# EasyEDA schematic SCH_USBHub_2025-11-01.json
TITLE: YetAnotherUSBHub; REV: 1.0; Date: 2025-10-31; Sheet: 1/1; Drawn By: 0x62
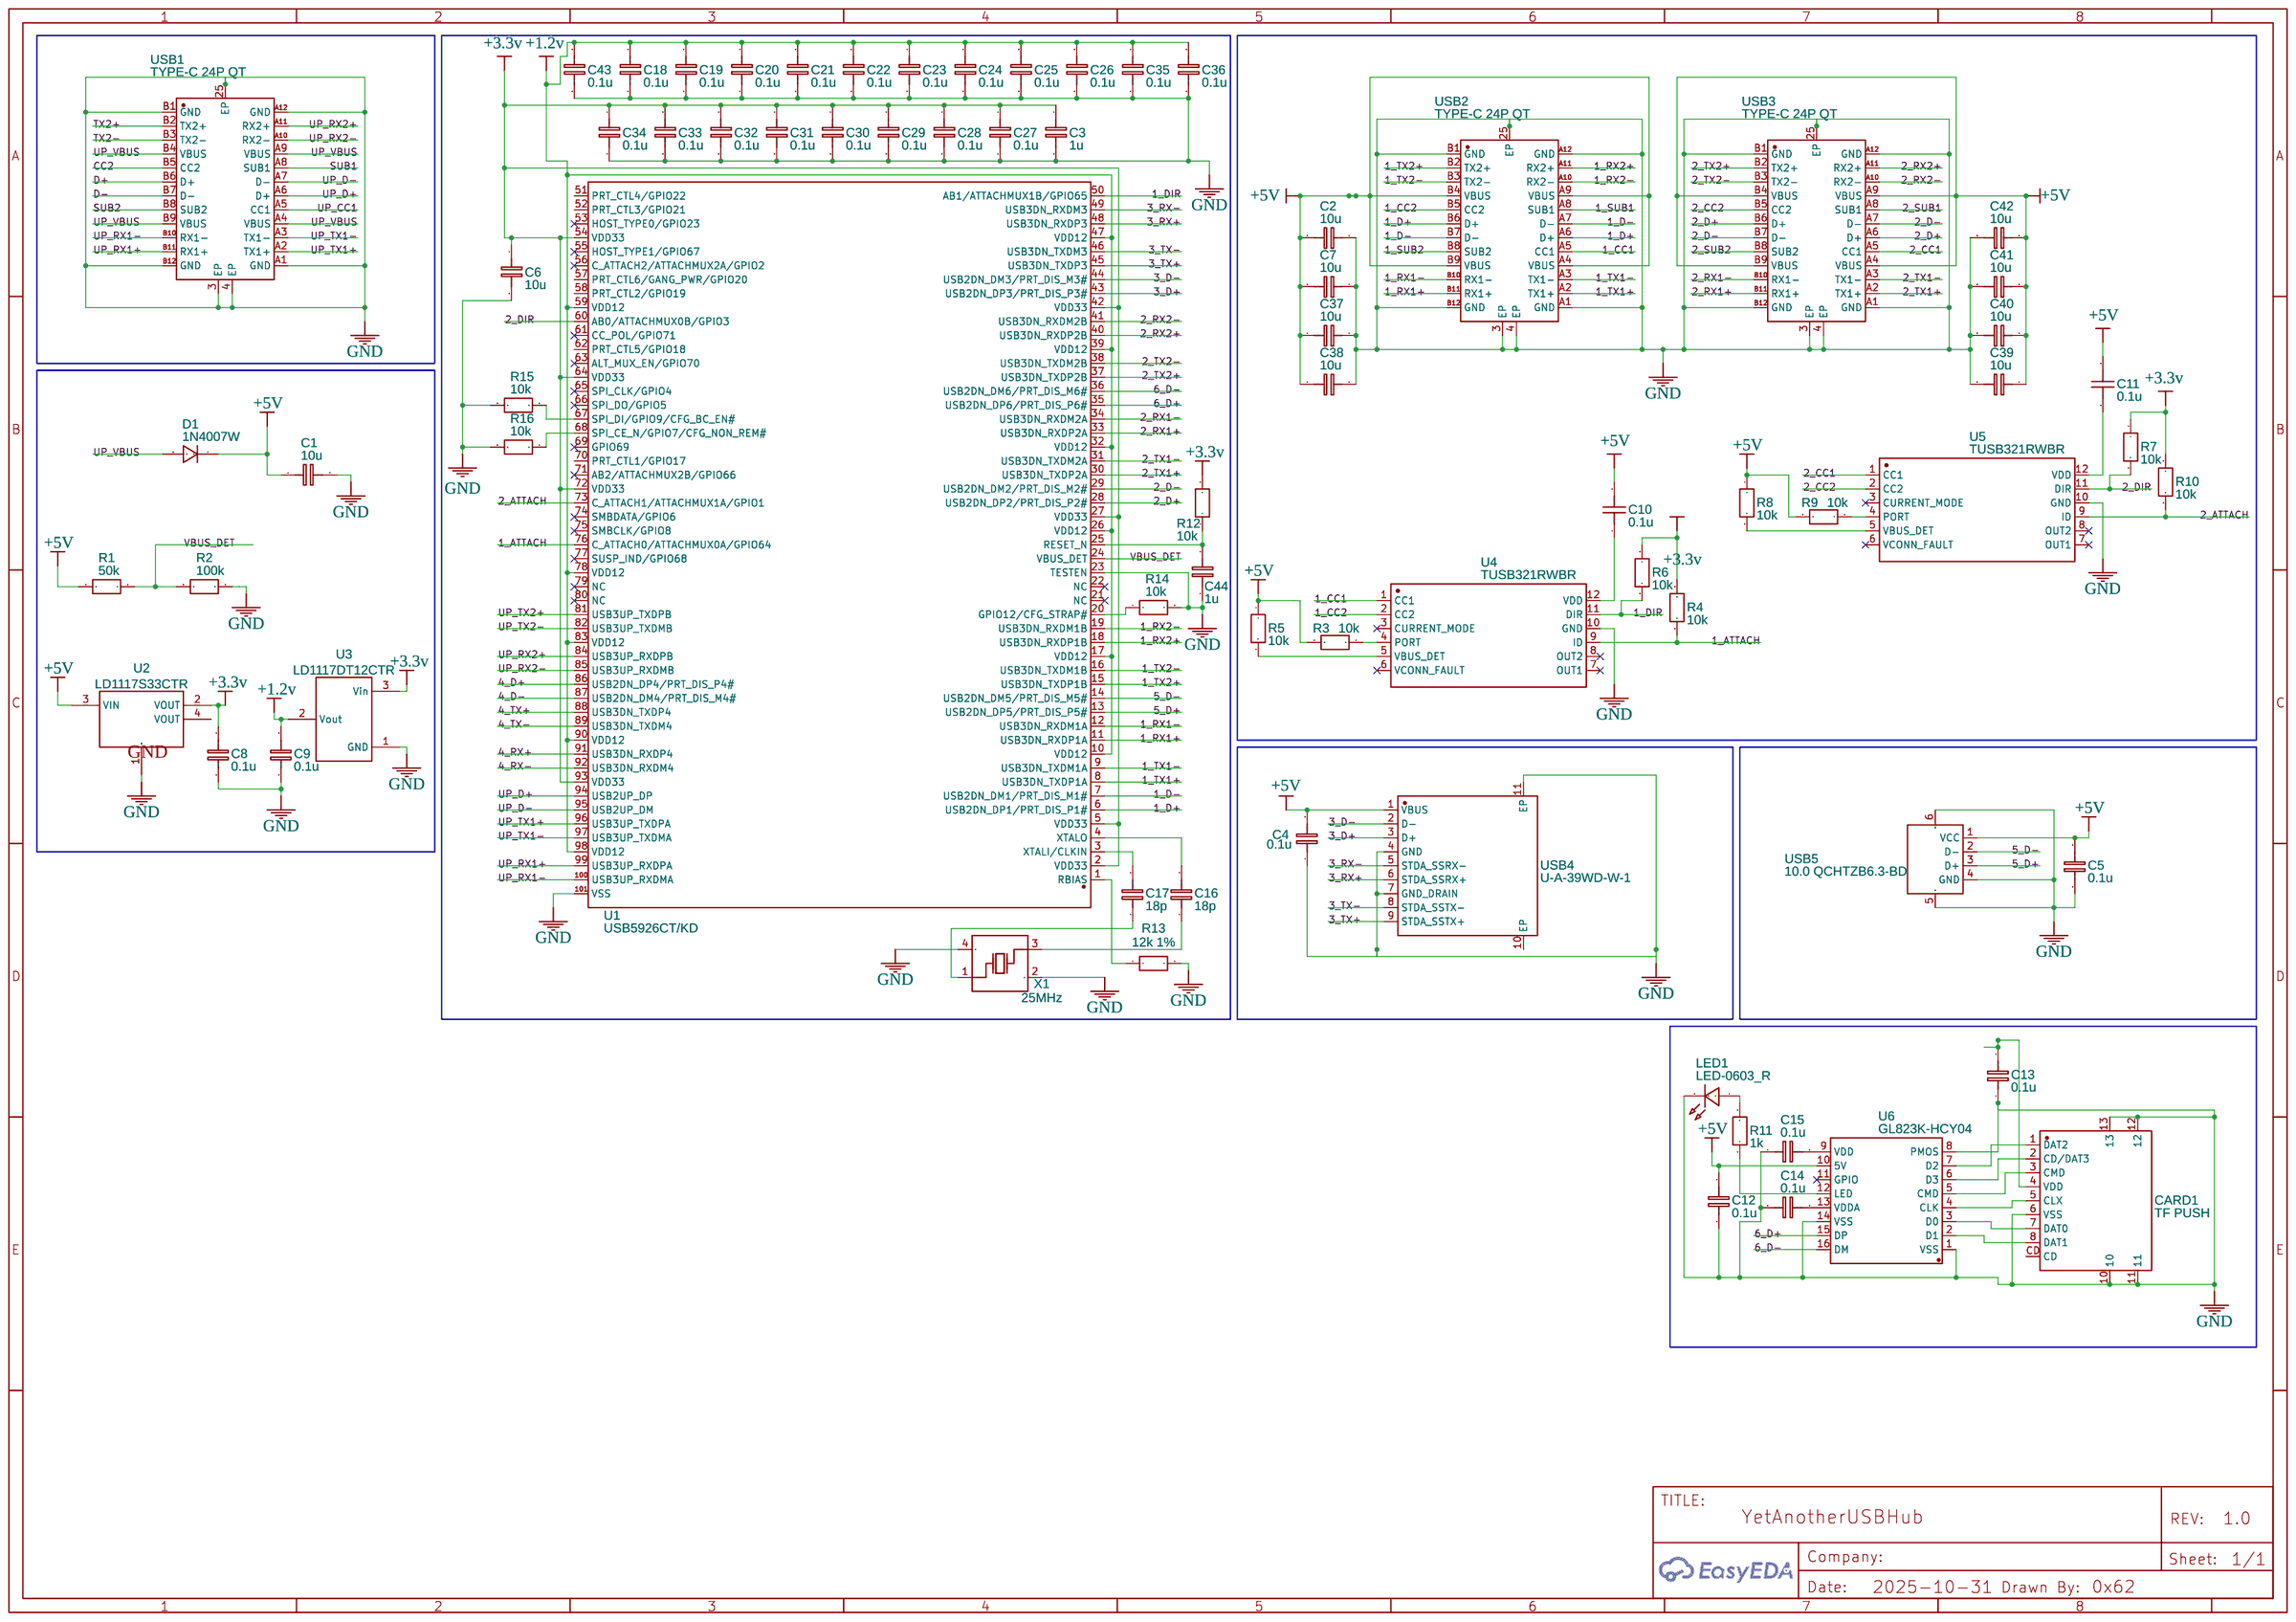
[diagram p0: schematic sheet]

## Parts
C1  10u  [C0603]
C2  10u  [C0603]
C3  1u  [C0603]
C4  0.1u  [C0603]
C5  0.1u  [C0603]
C6  10u  [C0603]
C7  10u  [C0603]
C8  0.1u  [C0603]
C9  0.1u  [C0603]
C10  0.1u  [C0603]
C11  0.1u  [C0603]
C12  0.1u  [C0603]
C13  0.1u  [C0603]
C14  0.1u  [C0603]
C15  0.1u  [C0603]
C16  18p  [C0603]
C17  18p  [C0603]
C18  0.1u  [C0603]
C19  0.1u  [C0603]
C20  0.1u  [C0603]
C21  0.1u  [C0603]
C22  0.1u  [C0603]
C23  0.1u  [C0603]
C24  0.1u  [C0603]
C25  0.1u  [C0603]
C26  0.1u  [C0603]
C27  0.1u  [C0603]
C28  0.1u  [C0603]
C29  0.1u  [C0603]
C30  0.1u  [C0603]
C31  0.1u  [C0603]
C32  0.1u  [C0603]
C33  0.1u  [C0603]
C34  0.1u  [C0603]
C35  0.1u  [C0603]
C36  0.1u  [C0603]
C37  10u  [C0603]
C38  10u  [C0603]
C39  10u  [C0603]
C40  10u  [C0603]
C41  10u  [C0603]
C42  10u  [C0603]
C43  0.1u  [C0603]
C44  1u  [C0603]
CARD1  TF PUSH  [TF-SMD_TF-PUSH]
D1  1N4007W  [SOD-123_L2.8-W1.8-LS3.7-RD]
LED1  LED-0603_R  [LED0603_RED]
R1  50k  [R0603]
R2  100k  [R0603]
R3  10k  [R0603]
R4  10k  [R0603]
R5  10k  [R0603]
R6  10k  [R0603]
R7  10k  [R0603]
R8  10k  [R0603]
R9  10k  [R0603]
R10  10k  [R0603]
R11  1k  [R0603]
R12  10k  [R0603]
R13  12k 1%  [R0603]
R14  10k  [R0603]
R15  10k  [R0603]
R16  10k  [R0603]
U1  USB5926CT/KD  [VQFN-100_L12.0-W12.0-P0.40-TL-EP8.0]
U2  LD1117S33CTR  [SOT-223-4_L6.5-W3.5-P2.30-LS7.0-BR]
U3  LD1117DT12CTR  [TO-252-3_L6.5-W5.8-P4.58-BL]
U4  TUSB321RWBR  [X2QFN-12_L1.6-W1.6-P0.40-TL]
U5  TUSB321RWBR  [X2QFN-12_L1.6-W1.6-P0.40-TL]
U6  GL823K-HCY04  [SSOP-16_L4.9-W3.9-P0.64-LS6.0-BL]
USB1  TYPE-C 24P QT  [USB-C-SMD_TYPE-C-24P-QT]
USB2  TYPE-C 24P QT  [USB-C-SMD_TYPE-C-24P-QT]
USB3  TYPE-C 24P QT  [USB-C-SMD_TYPE-C-24P-QT]
USB4  U-A-39WD-W-1  [USB-A-SMD_U-A-39WD-W-1]
USB5  10.0 QCHTZB6.3-BD  [USB-A-SMD_USB-A-SMD-4P]
X1  25MHz  [CRYSTAL-SMD_4P-L3.2-W2.5-BL]

## Library data of the parts
C1-C9 C12-C44 = C_0603_EU: Contributor: LCEDA_Lib
C10 C11 = C_0603_US: Contributor: LCEDA_Lib
CARD1 = TF PUSH: Contributor: LCSC; Supplier: LCSC; Supplier Part: C393941; Manufacturer: SHOU HAN(首韩); JLCPCB Part Class: Extended Part
D1 = 1N4007W: Supplier: LCSC; Supplier Part: C328592; Manufacturer: BLUE ROCKET; Contributor: LCEDA_Lib
LED1 = LED-0603_R: Manufacturer: EVERLIGHT(台湾亿光); Manufacturer Part: 19-217/R6C-AL1M2VY/3T; Supplier Part: C72044; Supplier: LCSC; Contributor: LCEDA_01
R1-R16 = R_0603_EU: Contributor: LCEDA_Lib
U1 = USB5926CT/KD: Contributor: lcsc; Supplier: LCSC; Supplier Part: C3210697; Manufacturer: MICROCHIP(美国微芯); JLCPCB Part Class: Extended Part
U2 = LD1117S33CTR: Supplier: LCSC; Manufacturer: ST(意法半导体); Supplier Part: C35879; JLCPCB Part Class: Extended Part
U3 = LD1117DT12CTR: Supplier: LCSC; Manufacturer: ST(意法半导体); Supplier Part: C81188; JLCPCB Part Class: Extended Part
U4 U5 = TUSB321RWBR: Contributor: LCSC; Supplier: LCSC; Manufacturer: TI(德州仪器); Supplier Part: C139392; JLCPCB Part Class: Extended Part
U6 = GL823K-HCY04: Contributor: LCSC; Supplier: LCSC; Supplier Part: C284879; Manufacturer: GENESYS(创惟); JLCPCB Part Class: Extended Part
USB1-USB3 = TYPE-C 24P QT: Contributor: LCSC; Supplier: LCSC; Supplier Part: C2681555; Manufacturer: SHOU HAN(首韩); JLCPCB Part Class: Extended Part
USB4 = U-A-39WD-W-1: Contributor: lcsc; Supplier: LCSC; Supplier Part: C3020886; Manufacturer: 韩国韩荣; JLCPCB Part Class: Extended Part
USB5 = 10.0 QCHTZB6.3-BD: Contributor: lcsc; Supplier: LCSC; Supplier Part: C2681561; Manufacturer: SHOU HAN(首韩); JLCPCB Part Class: Extended Part
X1 = X322525MOB4SI: Supplier: LCSC; Manufacturer: YXC(扬兴晶振); Supplier Part: C9006; JLCPCB Part Class: Basic Part

## Nets
+1.2v: C9.2 C18.1 C19.1 C20.1 C21.1 C22.1 C23.1 C24.1 C25.1 C26.1 C35.1 C36.1 C43.1 U1.10(VDD12) U1.17(VDD12) U1.26(VDD12) U1.32(VDD12) U1.39(VDD12) U1.47(VDD12) U1.59(VDD12) U1.78(VDD12) U1.83(VDD12) U1.90(VDD12) U1.98(VDD12) U3.2(Vout)
+3.3v: C3.1 C6.1 C8.2 C27.1 C28.1 C29.1 C30.1 C31.1 C32.1 C33.1 C34.1 R4.2 R6.1 R7.1 R10.2 R12.2 U1.2(VDD33) U1.5(VDD33) U1.27(VDD33) U1.42(VDD33) U1.54(VDD33) U1.64(VDD33) U1.72(VDD33) U1.93(VDD33) U2.2(VOUT) U3.3(Vin)
+5V: C1.1 C2.2 C4.2 C5.2 C7.2 C10.2 C11.1 C12.2 C37.2 C38.2 C39.1 C40.1 C41.1 C42.1 D1.1 R1.1 R3.2 R5.1 R8.1 R9.2 U2.3(VIN) U6.10(5V) USB2.A4(VBUS) USB2.A9(VBUS) USB2.B4(VBUS) USB2.B9(VBUS) USB3.A4(VBUS) USB3.A9(VBUS) USB3.B4(VBUS) USB3.B9(VBUS) USB4.1(VBUS) USB5.1(VCC)
GND: C1.2 C2.1 C3.2 C4.1 C5.1 C6.2 C7.1 C8.1 C9.1 C12.1 C13.1 C14.1 C15.1 C18.2 C19.2 C20.2 C21.2 C22.2 C23.2 C24.2 C25.2 C26.2 C27.2 C28.2 C29.2 C30.2 C31.2 C32.2 C33.2 C34.2 C35.2 C36.2 C37.1 C38.1 C39.2 C40.2 C41.2 C42.2 C43.2 C44.2 CARD1.6(VSS) CARD1.10 CARD1.11 CARD1.12 CARD1.13 LED1.2 R2.2 R13.2 R14.2 R15.2 R16.2 U1.23(TESTEN) U1.101(VSS) U2.1(GND) U3.1(GND) U4.10(GND) U5.10(GND) U6.1(VSS) U6.8(PMOS) U6.14(VSS) USB1.3(EP) USB1.4(EP) USB1.25(EP) USB1.A1(GND) USB1.A12(GND) USB1.B1(GND) USB1.B12(GND) USB2.3(EP) USB2.4(EP) USB2.25(EP) USB2.A1(GND) USB2.A12(GND) USB2.B1(GND) USB2.B12(GND) USB3.3(EP) USB3.4(EP) USB3.25(EP) USB3.A1(GND) USB3.A12(GND) USB3.B1(GND) USB3.B12(GND) USB4.4(GND) USB4.7(GND_DRAIN) USB4.11(EP) USB5.4(GND) USB5.5(SH1) USB5.6(SH2) X1.2(GND) X1.4(GND)
VBUS_DET: R1.2 R2.1 U1.24(VBUS_DET)
1_ATTACH: R4.1 U1.76(C_ATTACH0/ATTACHMUX0A/GPIO64) U4.9(ID)
1_CC1: U4.1(CC1) USB2.A5(CC1)
1_CC2: U4.2(CC2) USB2.B5(CC2)
1_D+: U1.6(USB2DN_DP1/PRT_DIS_P1#) USB2.A6(D+) USB2.B6(D+)
1_D-: U1.7(USB2DN_DM1/PRT_DIS_M1#) USB2.A7(D-) USB2.B7(D-)
1_DIR: R6.2 U1.50(AB1/ATTACHMUX1B/GPIO65) U4.11(DIR)
1_RX1+: U1.11(USB3DN_RXDP1A) USB2.B11(RX1+)
1_RX1-: U1.12(USB3DN_RXDM1A) USB2.B10(RX1-)
1_RX2+: U1.18(USB3DN_RXDP1B) USB2.A11(RX2+)
1_RX2-: U1.19(USB3DN_RXDM1B) USB2.A10(RX2-)
1_SUB1: USB2.A8(SUB1)
1_SUB2: USB2.B8(SUB2)
1_TX1+: U1.8(USB3DN_TXDP1A) USB2.A2(TX1+)
1_TX1-: U1.9(USB3DN_TXDM1A) USB2.A3(TX1-)
1_TX2+: U1.15(USB3DN_TXDP1B) USB2.B2(TX2+)
1_TX2-: U1.16(USB3DN_TXDM1B) USB2.B3(TX2-)
2_ATTACH: R10.1 U1.73(C_ATTACH1/ATTACHMUX1A/GPIO1) U5.9(ID)
2_CC1: U5.1(CC1) USB3.A5(CC1)
2_CC2: U5.2(CC2) USB3.B5(CC2)
2_D+: U1.28(USB2DN_DP2/PRT_DIS_P2#) USB3.A6(D+) USB3.B6(D+)
2_D-: U1.29(USB2DN_DM2/PRT_DIS_M2#) USB3.A7(D-) USB3.B7(D-)
2_DIR: R7.2 U1.60(AB0/ATTACHMUX0B/GPIO3) U5.11(DIR)
2_RX1+: U1.33(USB3DN_RXDP2A) USB3.B11(RX1+)
2_RX1-: U1.34(USB3DN_RXDM2A) USB3.B10(RX1-)
2_RX2+: U1.40(USB3DN_RXDP2B) USB3.A11(RX2+)
2_RX2-: U1.41(USB3DN_RXDM2B) USB3.A10(RX2-)
2_SUB1: USB3.A8(SUB1)
2_SUB2: USB3.B8(SUB2)
2_TX1+: U1.30(USB3DN_TXDP2A) USB3.A2(TX1+)
2_TX1-: U1.31(USB3DN_TXDM2A) USB3.A3(TX1-)
2_TX2+: U1.37(USB3DN_TXDP2B) USB3.B2(TX2+)
2_TX2-: U1.38(USB3DN_TXDM2B) USB3.B3(TX2-)
3_D+: U1.43(USB2DN_DP3/PRT_DIS_P3#) USB4.3(D+)
3_D-: U1.44(USB2DN_DM3/PRT_DIS_M3#) USB4.2(D-)
3_RX+: U1.48(USB3DN_RXDP3) USB4.6(STDA_SSRX+)
3_RX-: U1.49(USB3DN_RXDM3) USB4.5(STDA_SSRX-)
3_TX+: U1.45(USB3DN_TXDP3) USB4.9(STDA_SSTX+)
3_TX-: U1.46(USB3DN_TXDM3) USB4.8(STDA_SSTX-)
4_D+: U1.86(USB2DN_DP4/PRT_DIS_P4#)
4_D-: U1.87(USB2DN_DM4/PRT_DIS_M4#)
4_RX+: U1.91(USB3DN_RXDP4)
4_RX-: U1.92(USB3DN_RXDM4)
4_TX+: U1.88(USB3DN_TXDP4)
4_TX-: U1.89(USB3DN_TXDM4)
5_D+: U1.13(USB2DN_DP5/PRT_DIS_P5#) USB5.3(D+)
5_D-: U1.14(USB2DN_DM5/PRT_DIS_M5#) USB5.2(D-)
6_D+: U1.35(USB2DN_DP6/PRT_DIS_P6#) U6.15(DP)
6_D-: U1.36(USB2DN_DM6/PRT_DIS_M6#) U6.16(DM)
CC2: USB1.B5(CC2)
D+: USB1.B6(D+)
D-: USB1.B7(D-)
SUB1: USB1.A8(SUB1)
SUB2: USB1.B8(SUB2)
TX2+: USB1.B2(TX2+)
TX2-: USB1.B3(TX2-)
UP_CC1: USB1.A5(CC1)
UP_D+: U1.94(USB2UP_DP) USB1.A6(D+)
UP_D-: U1.95(USB2UP_DM) USB1.A7(D-)
UP_RX1+: U1.99(USB3UP_RXDPA) USB1.B11(RX1+)
UP_RX1-: U1.100(USB3UP_RXDMA) USB1.B10(RX1-)
UP_RX2+: U1.84(USB3UP_RXDPB) USB1.A11(RX2+)
UP_RX2-: U1.85(USB3UP_RXDMB) USB1.A10(RX2-)
UP_TX1+: U1.96(USB3UP_TXDPA) USB1.A2(TX1+)
UP_TX1-: U1.97(USB3UP_TXDMA) USB1.A3(TX1-)
UP_TX2+: U1.81(USB3UP_TXDPB)
UP_TX2-: U1.82(USB3UP_TXDMB)
UP_VBUS: D1.2 USB1.A4(VBUS) USB1.A9(VBUS) USB1.B4(VBUS) USB1.B9(VBUS)
Net-(C10-1): C10.1 U4.12(VDD)
Net-(C11-2): C11.2 U5.12(VDD)
Net-(C13-2): C13.2 CARD1.4(VDD)
Net-(C14-2): C14.2 U6.13(VDDA)
Net-(C15-2): C15.2 U6.9(VDD)
Net-(C16-1): C16.1 X1.3(OSC2)
Net-(C16-2): C16.2 U1.4(XTALO)
Net-(C17-1): C17.1 X1.1(OSC1)
Net-(C17-2): C17.2 U1.3(XTALI/CLKIN)
Net-(C44-1): C44.1 R12.1 U1.25(RESET_N)
Net-(CARD1-1): CARD1.1(DAT2) U6.7(D2)
Net-(CARD1-2): CARD1.2(CD/DAT3) U6.6(D3)
Net-(CARD1-3): CARD1.3(CMD) U6.5(CMD)
Net-(CARD1-5): CARD1.5(CLX) U6.4(CLK)
Net-(CARD1-7): CARD1.7(DAT0) U6.3(D0)
Net-(CARD1-8): CARD1.8(DAT1) U6.2(D1)
Net-(LED1-1): LED1.1 R11.2
Net-(R3-1): R3.1 U4.4(PORT)
Net-(R5-2): R5.2 U4.5(VBUS_DET)
Net-(R8-2): R8.2 U5.5(VBUS_DET)
Net-(R9-1): R9.1 U5.4(PORT)
Net-(R11-1): R11.1 U6.12(LED)
Net-(R13-1): R13.1 U1.1(RBIAS)
Net-(R14-1): R14.1 U1.20(GPIO12/CFG_STRAP#)
Net-(R15-1): R15.1 U1.67(SPI_DI/GPIO9/CFG_BC_EN#)
Net-(R16-1): R16.1 U1.68(SPI_CE_N/GPIO7/CFG_NON_REM#)

Not connected (* = marked no-connect by the designer): CARD1 CD; U1 21(NC)* 22(NC)* 51(PRT_CTL4/GPIO22) 52(PRT_CTL3/GPIO21) 53(HOST_TYPE0/GPIO23)* 55(HOST_TYPE1/GPIO67)* 56(C_ATTACH2/ATTACHMUX2A/GPIO2)* 57(PRT_CTL6/GANG_PWR/GPIO20) 58(PRT_CTL2/GPIO19) 61(CC_POL/GPIO71)* 62(PRT_CTL5/GPIO18) 63(ALT_MUX_EN/GPIO70)* 65(SPI_CLK/GPIO4)* 66(SPI_DO/GPIO5)* 69(GPIO69)* 70(PRT_CTL1/GPIO17) 71(AB2/ATTACHMUX2B/GPIO66)* 74(SMBDATA/GPIO6)* 75(SMBCLK/GPIO8)* 77(SUSP_IND/GPIO68)* 79(NC)* 80(NC)*; U2 4(VOUT); U4 3(CURRENT_MODE)* 6(VCONN_FAULT)* 7(OUT1)* 8(OUT2)*; U5 3(CURRENT_MODE)* 6(VCONN_FAULT)* 7(OUT1)* 8(OUT2)*; U6 11(GPIO)*; USB4 10(EP)
